# EAGLE design Singularitron IR Thermometer Module v1 (EAGLE 7.3.0)
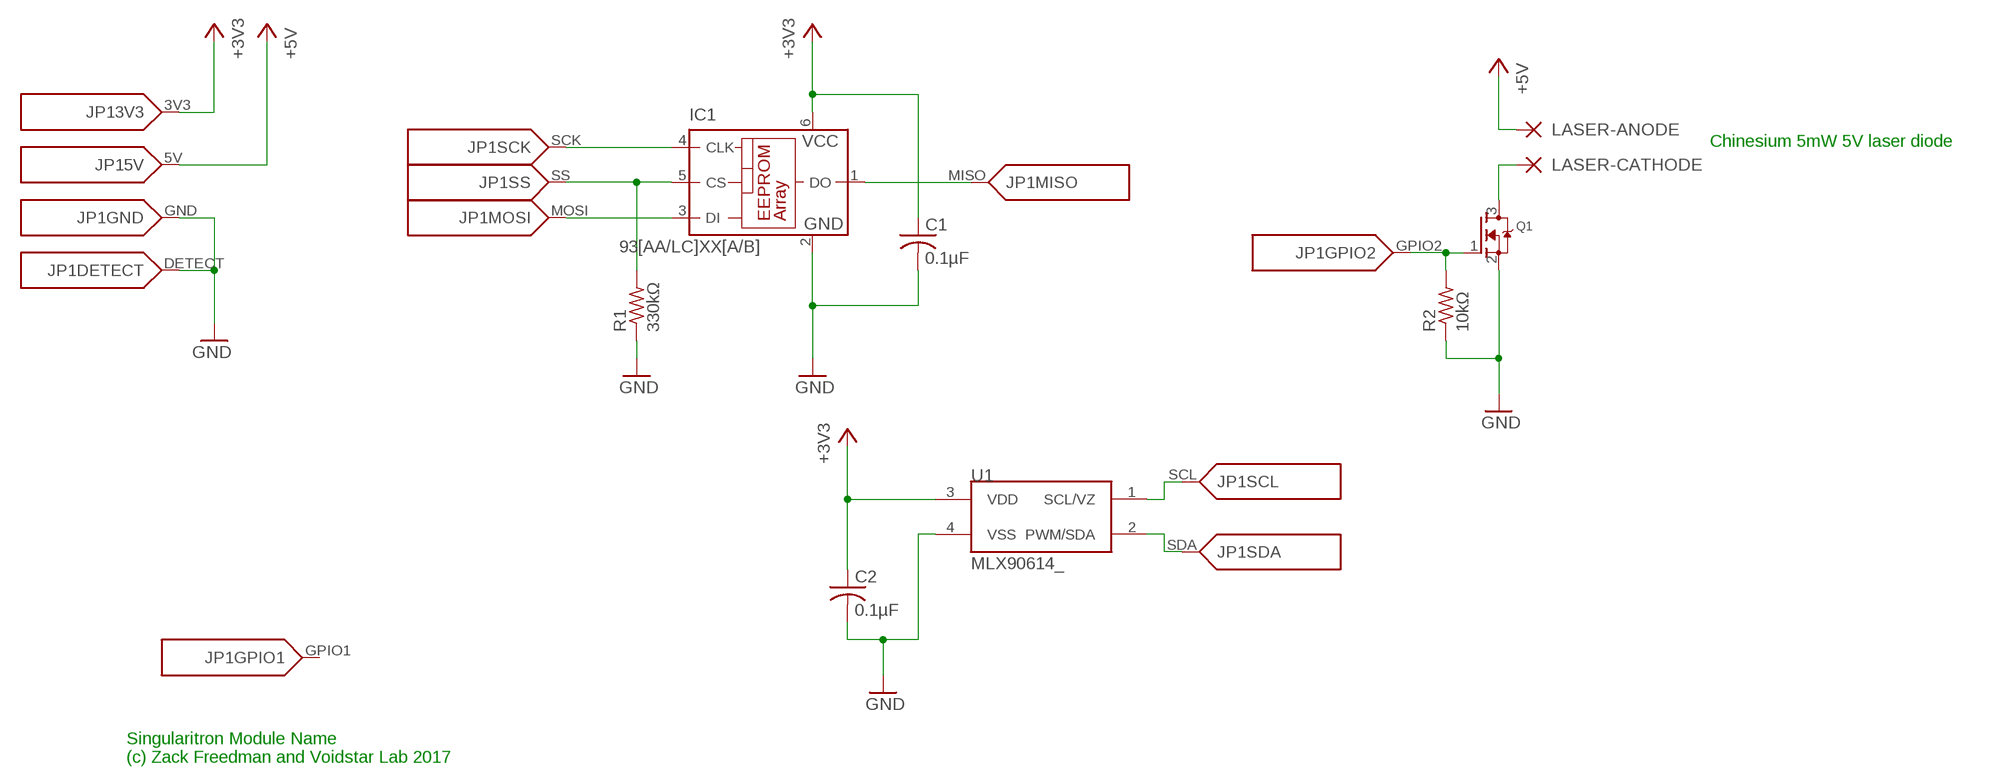
[diagram p0: schematic, sheet 1]

## Parts
C1  0.1µF  C-USC0603  [C0603]
C2  0.1µF  C-USC0603  [C0603]
IC1  93[AA/LC]XX[A/B]  93AA76A  [SOT23-6]
JP1  SINGULARITRON_CART_BASE  [SINGULARITRON_CART_BASE]
LASER-ANODE  1,6/0,9  [1,6/0,9]
LASER-CATHODE  1,6/0,9  [1,6/0,9]
Q1  MOSFET-NREFLOW  [SOT23]
R1  330kΩ  R-US_R0603  [R0603]
R2  10kΩ  R-US_R0603  [R0603]
U1  MLX90614_  [TO-39]

## Nets
+3V3: C1.1 C2.1 IC1.6(VCC) JP1.3V3 U1.3(VDD)
+5V: JP1.5V LASER-ANODE.1(P)
GND: C1.2 C2.2 IC1.2(GND) JP1.DETECT JP1.GND Q1.2(S) R1.1 R2.1 U1.4(VSS)
LASER: JP1.GPIO2 Q1.1(G) R2.2
N$1: IC1.5(CS) JP1.SS R1.2
N$2: JP1.SCL U1.1(SCL/VZ)
N$3: JP1.SDA U1.2(PWM/SDA)
N$4: LASER-CATHODE.1(P) Q1.3(D)
N$5: IC1.4(CLK) JP1.SCK
N$6: IC1.3(DI) JP1.MOSI
N$7: IC1.1(DO) JP1.MISO
Unconnected: JP1.GPIO1

## Notes on the sheet
- Chinesium 5mW 5V laser diode
- Singularitron Module Name
  (c) Zack Freedman and Voidstar Lab 2017

## Library data of the parts
C1 C2 = rcl:C-US: CAPACITOR, American symbol
IC1 = microchip:93*76?: 8K Microwire Compatible Serial EEPROM Source: http://ww1.microchip.com/downloads/en/DeviceDoc/21796H.pdf; MPN: 93AA76AT-I/OT; OC_FARNELL: 1331443; OC_NEWARK: 35M2481
JP1 = Voidstar-Exotic:SINGULARITRON_CART_BASE
LASER-ANODE LASER-CATHODE = wirepad:1,6/0,9: THROUGH-HOLE PAD
Q1 = adafruit:MOSFET-N: N-Channel Mosfet 2N7002E - 60V 260mA SOT23 [Digikey: 2N7002ET1GOSTR-ND] - REEL BSH103 - 30V 850mA SOT23 [Digikey: 568-5013-1-ND]
R1 R2 = rcl:R-US_: RESISTOR, American symbol
U1 = SparkFun-Sensors:MLX90614: Non-contact PIR I2C interface temperature sensor

## Board
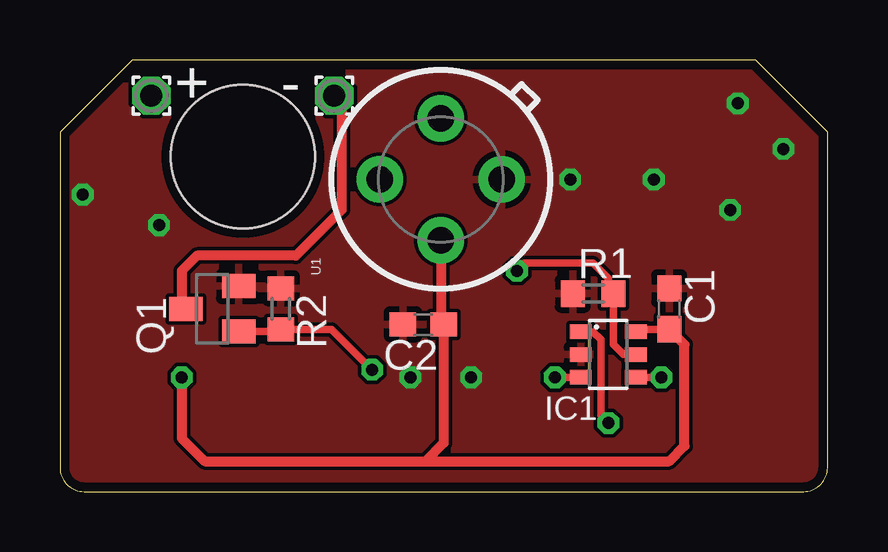
[diagram p1: board, top side]
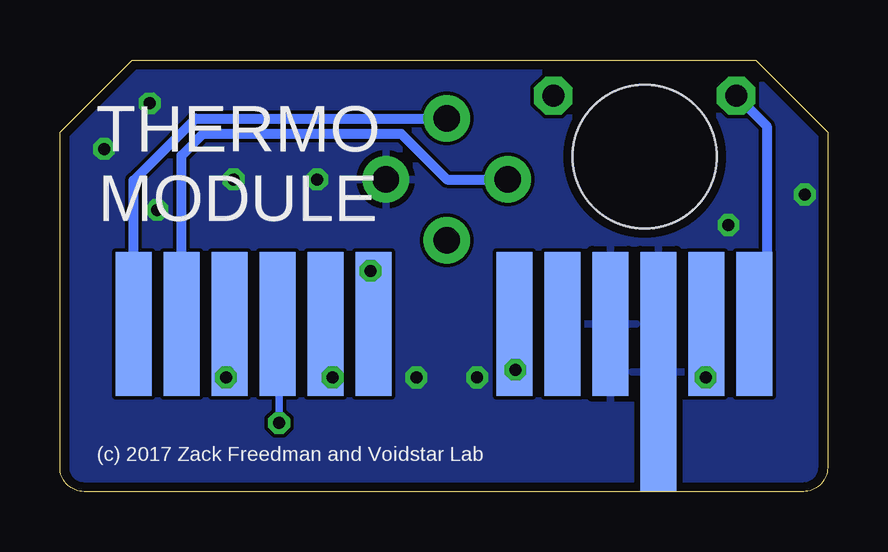
[diagram p2: board, bottom side, seen from below]

Size 32 x 18 mm. Coordinates in mm from the lower left corner, seen from the top.
Outline: 29,18 3,18 0,15 0,1 arc90 1,0 31,0 arc90 32,1 32,15 29,18
Copper layers (1*2*15*16): Top 0.035559375mm / dielectric 1.501140625mm / Route2 0.035559375mm / dielectric 0.149859375mm / Route15 0.035559375mm / dielectric 0.200659375mm / Bottom 0.035559375mm
Design rules "dl-Singularitron 1B": minimum track width 7mil, minimum drill 15mil, track to track 6mil, track to pad 6mil, pad to pad 6mil, via to via 6mil, smd to smd 6mil, copper to edge 15mil, drill to drill 8mil, minimum pad ring 4mil, minimum via ring 8mil, stop-mask expansion 2mil, vias tented up to drill 24mil, thermal gap 10mil
Holes 6 mm at 7.62,13.97

### Footprints (pad centres in the part's own frame; a part is rotated, then mirrored left to right if it is on the bottom)
C0603 = smd 1.1 x 1: 1 -0.85,0; 2 0.85,0
SOT23-6 = smd 0.6 x 0.9: 1 -0.95,-1.15; 2 0,-1.15; 3 0.95,-1.15; 4 0.95,1.15; 5 0,1.15; 6 -0.95,1.15
SINGULARITRON_CART_BASE = smd 1.5 x 6 bottom: 3V3 5.062,7; 5V 3.062,7; DETECT 9.062,7; GPIO1 11.062,7; GPIO2 13.062,7; MISO 22.938,7; MOSI 20.938,7; SCK 24.938,7; SCL 28.938,7; SDA 26.938,7; SS 18.938,7 | smd 1.5 x 10 bottom: GND 7.062,5
1,6/0,9 = drill 0.914 pad 1.6 octagon: 1 0,0
SOT23 = smd 1 x 1.4: 1 -0.95,-1.1; 2 0.95,-1.1; 3 0,1.1
R0603 = smd 1 x 1.1: 1 -0.85,0; 2 0.85,0
TO-39 = drill 1.1 pad 1.93: 1 2.54,0; 2 0,2.54; 3 -2.54,0; 4 0,-2.54

### Placement (x,y rotation side)
C1  25.4,7.62 90 top
C2  15.15,6.97 180 top
IC1  22.86,5.71 270 top
JP1  0,0 0 top
LASER-ANODE  3.81,16.51 0 top
LASER-CATHODE  11.43,16.51 0 top
Q1  6.35,7.62 90 top
R1  22.23,8.26 0 top
R2  9.21,7.62 270 top
U1  15.88,13.02 90 top

### Tracks (layer width: path | path; a pad name or v marks a point on that pad's centre or on a via)
+3V3  (via drill 0.5)
  Top 0.305: C1.1 24.11,6.77 IC1.6
  Top 0.406: v5.08,4.76 5.08,2.22 6.03,1.27 15.24,1.27 | 15.24,1.27 25.4,1.27 26.04,1.91 26.04,6.13 C1.1 | U1.3 15.88,7.09 C2.1 16,2.03 15.24,1.27
  Bottom 0.305: JP1.3V3 5.08,6.98 v5.08,4.76
+5V
  Bottom 0.406: LASER-ANODE.1 2.54,15.24 2.54,9.21 3.06,8.69 JP1.5V
GND  (via drill 0.5)
  other vias: 4.13,11.11 14.61,4.76 28.26,16.19 30.16,14.29 24.77,13.02 0.95,12.38 17.14,4.76 21.27,13.02 27.94,11.75
  pour Top: 0,0 0,19.05 33.02,19.05 33.02,0
  pour Bottom: 0,0 0,19.05 33.02,19.05 33.02,0
LASER  (via drill 0.5)
  Top 0.305: Q1.1 9.21,6.67 R2.2 11.33,6.77 v13.02,5.08
  Bottom 0.305: v13.02,5.08 13.02,6.96 JP1.GPIO2
N$1  (via drill 0.5)
  Top 0.305: v19.05,9.21 19.37,9.53 22.23,9.53 22.86,8.89 22.86,8.47 R1.2 23.07,6.13 23.5,5.71 IC1.5
  Bottom 0.305: JP1.SS 18.94,9.1 v19.05,9.21
N$2
  Bottom 0.406: JP1.SCL 28.94,12.97 26.35,15.56 U1.1
N$3
  Bottom 0.406: JP1.SDA 26.94,14.02 26.04,14.92 17.78,14.92 15.88,13.02 U1.2
N$4
  Top 0.406: LASER-CATHODE.1 11.43,16.19 11.75,15.88 11.75,11.75 9.84,9.84 5.71,9.84 5.08,9.21 5.08,7.79 Q1.3
N$5  (via drill 0.5)
  Top 0.305: IC1.4 v25.08,4.77 v25.08,4.76
  Bottom 0.305: JP1.SCK 24.94,4.91 v25.08,4.76
N$6  (via drill 0.5)
  Top 0.305: IC1.3 v20.64,4.77 v20.64,4.76
  Bottom 0.305: JP1.MOSI 20.94,5.06 v20.64,4.76
N$7  (via drill 0.5)
  Top 0.305: IC1.1 22.23,6.66 22.54,6.35 22.54,3.18 v22.86,2.86
  Bottom 0.305: JP1.MISO 22.86,6.92 v22.86,2.86

### Text on the board
tPlace: + | -
bPlace: THERMO / MODULE | (c) 2017 Zack Freedman and Voidstar Lab